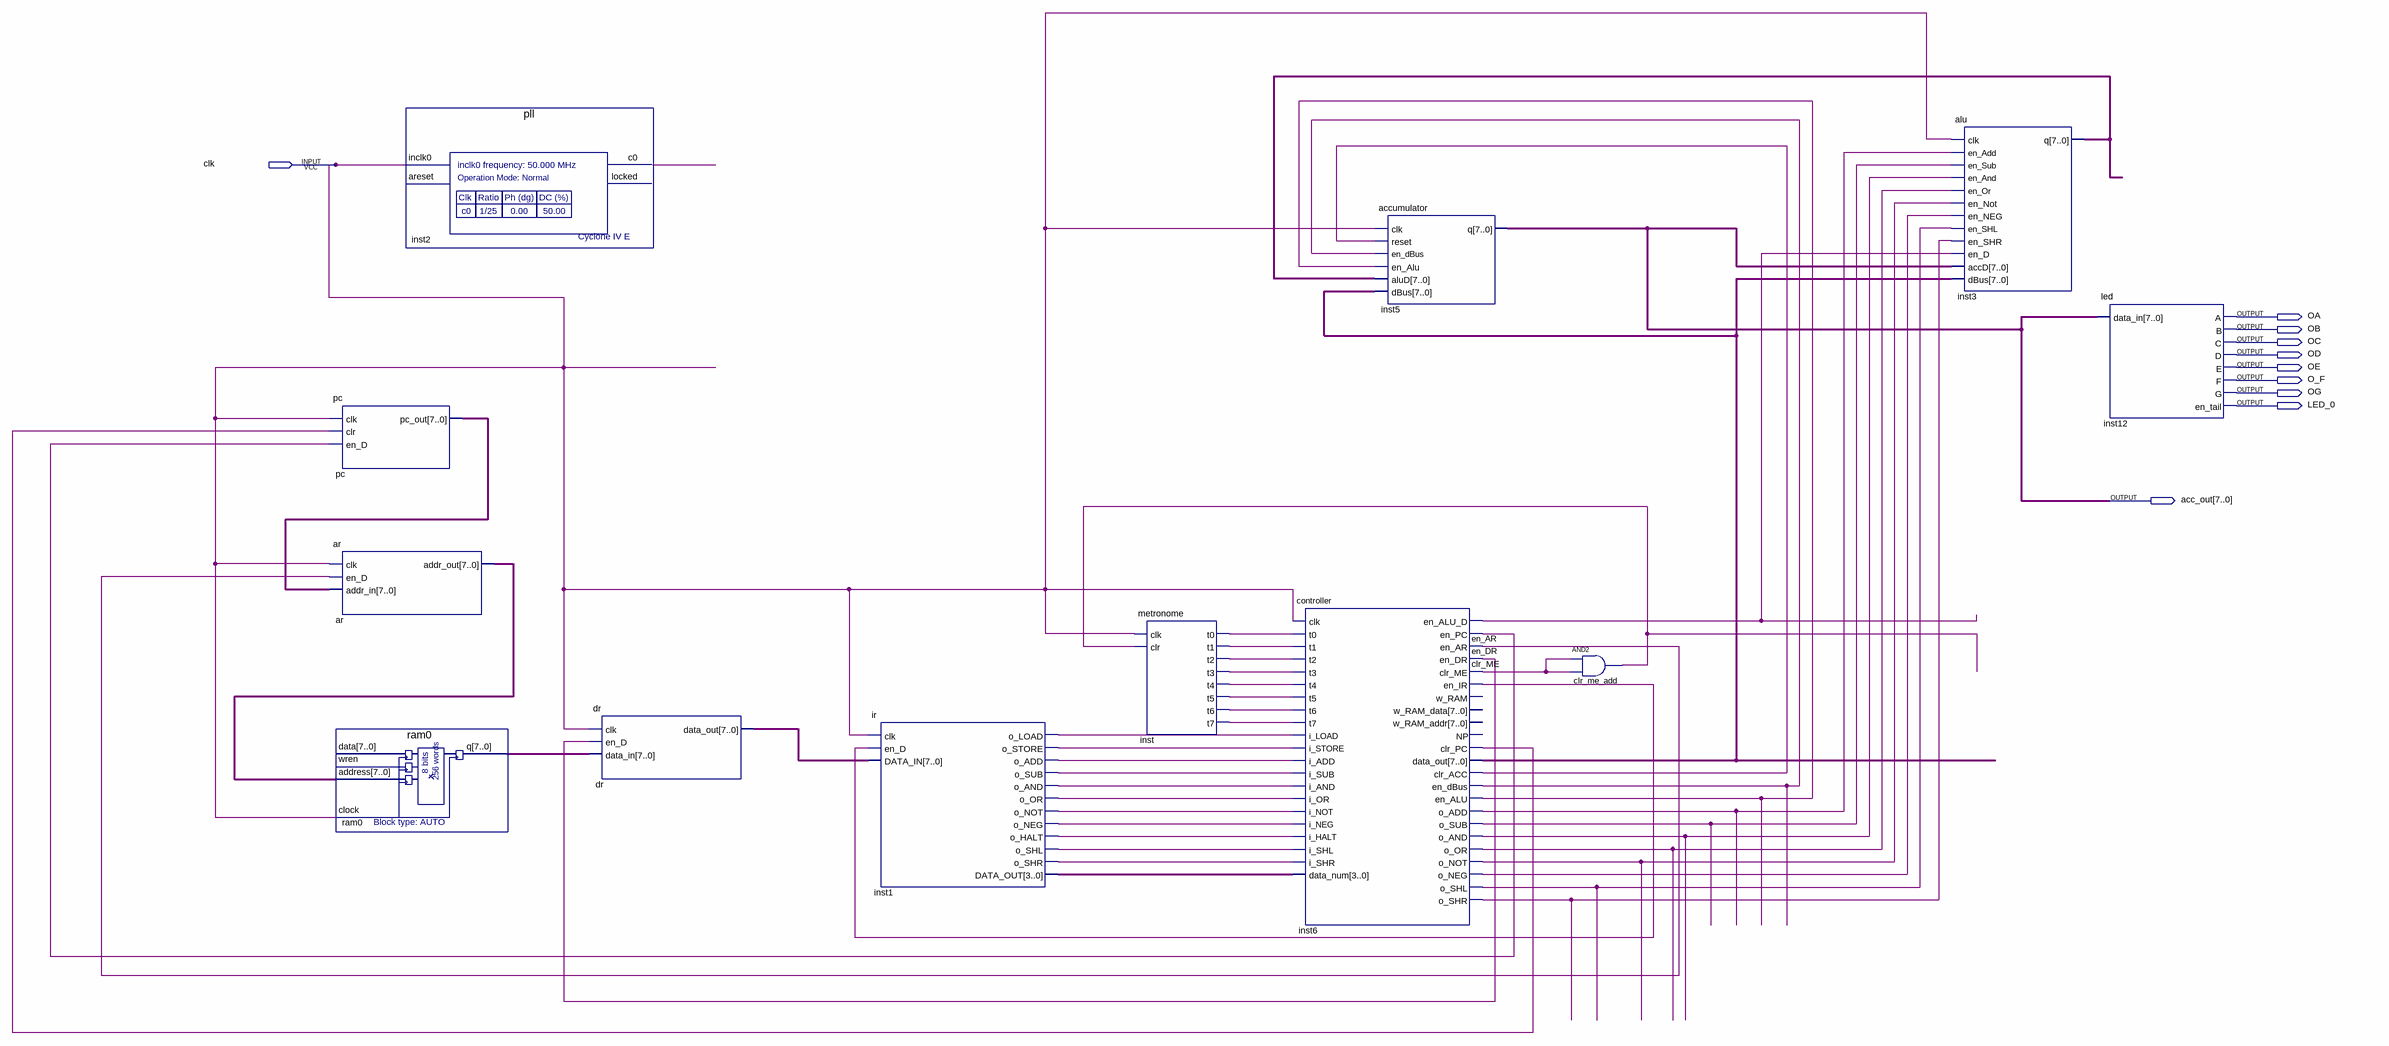
[diagram p0: schematic sheet]
// Quartus schematic eight_bit_model.bdf as structural Verilog: 12 symbols, 10 pins
module eight_bit_model (
  input  clk,
  output OA,
  output OB,
  output OC,
  output OD,
  output OE,
  output O_F,
  output OG,
  output LED_0,
  output [7:0] acc_out
);

  wire clr_ME, clr_me_add_out, en_AR, en_DR, inst1_o_add, inst1_o_and, inst1_o_halt, inst1_o_load,
       inst1_o_neg, inst1_o_not, inst1_o_or, inst1_o_shl, inst1_o_shr, inst1_o_store, inst1_o_sub, inst2_c0,
       inst6_clr_acc, inst6_clr_pc, inst6_en_alu, inst6_en_alu_d, inst6_en_dbus, inst6_en_ir, inst6_en_pc,
       inst6_o_add, inst6_o_and, inst6_o_neg, inst6_o_not, inst6_o_or, inst6_o_shl, inst6_o_shr, inst6_o_sub,
       inst_t0, inst_t1, inst_t2, inst_t3, inst_t4, inst_t5, inst_t6, inst_t7;
  wire [3:0] inst1_data_out;
  wire [7:0] ar_addr_out, dr_data_out, inst3_q, inst6_data_out, pc_pc_out, ram0_q;

  pc pc (.clk(clk), .clr(inst6_clr_pc), .en_D(inst6_en_pc), .pc_out(pc_pc_out));
  ar ar (.clk(clk), .en_D(en_AR), .addr_in(pc_pc_out), .addr_out(ar_addr_out));
  ram0 ram0 (.address(ar_addr_out), .clock(clk), .q(ram0_q));  // open: data, wren
  pll inst2 (.inclk0(clk), .c0(inst2_c0));  // open: areset, locked
  dr dr (.clk(clk), .en_D(en_DR), .data_in(ram0_q), .data_out(dr_data_out));
  ir inst1 (
    .clk(clk), .en_D(inst6_en_ir), .DATA_IN(dr_data_out), .o_LOAD(inst1_o_load), .o_STORE(inst1_o_store),
    .o_ADD(inst1_o_add), .o_SUB(inst1_o_sub), .o_AND(inst1_o_and), .o_OR(inst1_o_or), .o_NOT(inst1_o_not),
    .o_NEG(inst1_o_neg), .o_HALT(inst1_o_halt), .o_SHL(inst1_o_shl), .o_SHR(inst1_o_shr),
    .DATA_OUT(inst1_data_out));
  metronome inst (
    .clk(clk), .clr(clr_me_add_out), .t0(inst_t0), .t1(inst_t1), .t2(inst_t2), .t3(inst_t3), .t4(inst_t4),
    .t5(inst_t5), .t6(inst_t6), .t7(inst_t7));
  controller inst6 (
    .clk(clk), .t0(inst_t0), .t1(inst_t1), .t2(inst_t2), .t3(inst_t3), .t4(inst_t4), .t5(inst_t5),
    .t6(inst_t6), .t7(inst_t7), .i_LOAD(inst1_o_load), .i_STORE(inst1_o_store), .i_ADD(inst1_o_add),
    .i_SUB(inst1_o_sub), .i_AND(inst1_o_and), .i_OR(inst1_o_or), .i_NOT(inst1_o_not), .i_NEG(inst1_o_neg),
    .i_HALT(inst1_o_halt), .i_SHL(inst1_o_shl), .i_SHR(inst1_o_shr), .data_num(inst1_data_out),
    .en_ALU_D(inst6_en_alu_d), .en_PC(inst6_en_pc), .en_AR(en_AR), .en_DR(en_DR), .clr_ME(clr_ME),
    .en_IR(inst6_en_ir), .clr_PC(inst6_clr_pc), .data_out(inst6_data_out), .clr_ACC(inst6_clr_acc),
    .en_dBus(inst6_en_dbus), .en_ALU(inst6_en_alu), .o_ADD(inst6_o_add), .o_SUB(inst6_o_sub),
    .o_AND(inst6_o_and), .o_OR(inst6_o_or), .o_NOT(inst6_o_not), .o_NEG(inst6_o_neg), .o_SHL(inst6_o_shl),
    .o_SHR(inst6_o_shr));  // open: w_RAM, w_RAM_data, w_RAM_addr, NP
  accumulator inst5 (
    .clk(clk), .reset(inst6_clr_acc), .en_dBus(inst6_en_dbus), .en_Alu(inst6_en_alu), .aluD(inst3_q),
    .dBus(inst6_data_out), .q(acc_out));
  and clr_me_add (clr_me_add_out, clr_ME, clr_ME);
  alu inst3 (
    .clk(clk), .en_Add(inst6_o_add), .en_Sub(inst6_o_sub), .en_And(inst6_o_and), .en_Or(inst6_o_or),
    .en_Not(inst6_o_not), .en_NEG(inst6_o_neg), .en_SHL(inst6_o_shl), .en_SHR(inst6_o_shr),
    .en_D(inst6_en_alu_d), .accD(acc_out), .dBus(inst6_data_out), .q(inst3_q));
  led inst12 (.data_in(acc_out), .A(OA), .B(OB), .C(OC), .D(OD), .E(OE), .F(O_F), .G(OG), .en_tail(LED_0));
endmodule
